# EAGLE design isp renew2 (EAGLE 6.1)
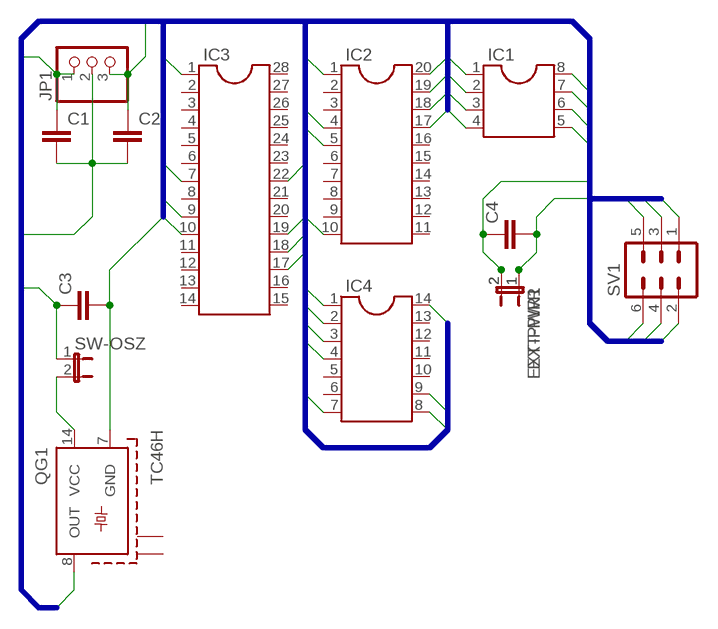
[diagram p0: schematic, sheet 1]

## Parts
C1  C-EU025-025X050  [C025-025X050]
C2  C-EU025-025X050  [C025-025X050]
C3  C-EU025-024X044  [C025-024X044]
C4  C-EU025-025X050  [C025-025X050]
EXT-PWR  JP1E  [JP1]
EXT-PWR1  JP1E  [JP1]
IC1  DIL8  [DIL08]
IC2  DIL20  [DIL20]
IC3  DIL28-3  [DIL28-3]
IC4  DIL14  [DIL14]
JP1  PINHD-1X3  [1X03]
QG1  TC46H  [TC46]
SV1  ML6  [ML6]
SW-OSZ  JP1E  [JP1]

## Nets
GND: C1.2 C2.2 C3.2 C4.2 EXT-PWR1.1 EXT-PWR.1 IC1.4 IC2.10 IC3.22 IC4.14 JP1.2 QG1.7(GND) SV1.6
MISO: IC1.6 IC2.18 IC3.18 IC4.8 SV1.1
MOSI: IC1.5 IC2.17 IC3.17 IC4.7 SV1.4
N$1: QG1.14(VCC) SW-OSZ.2
RESET: IC1.1 IC2.1 IC3.1 IC4.4 SV1.5
SCK: IC1.7 IC2.19 IC3.19 IC4.9 SV1.3
VCC: C3.1 C4.1 EXT-PWR1.2 EXT-PWR.2 IC1.8 IC2.20 IC3.7 IC4.1 SV1.2 SW-OSZ.1
XTAL1: C1.1 IC1.2 IC2.4 IC3.9 IC4.2 JP1.1 QG1.8(OUT)
XTAL2: C2.1 IC1.3 IC2.5 IC3.10 IC4.3 JP1.3
Unconnected: IC2.2 IC2.3 IC2.6 IC2.7 IC2.8 IC2.9 IC2.11 IC2.12 IC2.13 IC2.14 IC2.15 IC2.16 IC3.2 IC3.3 IC3.4 IC3.5 IC3.6 IC3.8 IC3.11 IC3.12 IC3.13 IC3.14 IC3.15 IC3.16 IC3.20 IC3.21 IC3.23 IC3.24 IC3.25 IC3.26 IC3.27 IC3.28 IC4.5 IC4.6 IC4.10 IC4.11 IC4.12 IC4.13 QG1.S@1(S1) QG1.S@2(S2)

## Buses
LINE:MOSI,MISO,RESET,SCK,VCC,GND,XTAL1,XTAL2

## Library data of the parts
C1-C4 = rcl:C-EU: CAPACITOR, European symbol
EXT-PWR EXT-PWR1 SW-OSZ = jumper:JP1E: JUMPER
IC1 = ic-package:DIL8: Dual In Line / Socket
IC2 = ic-package:DIL20: Dual In Line / Socket
IC3 = ic-package:DIL28: Dual In Line
IC4 = ic-package:DIL14: Dual In Line / Socket
JP1 = pinhead:PINHD-1X3: PIN HEADER
QG1 = crystal:TC46: Temperature Compensated Xtal Oscillator HCMOS, Clipped Sine Wave or Sine Wave Compatible Source: www.pletronics.com .. tc4.pdf; OC_FARNELL: unknown; OC_NEWARK: unknown
SV1 = con-harting-ml:ML6: HARTING; OC_FARNELL: unknown; OC_NEWARK: unknown

## Board
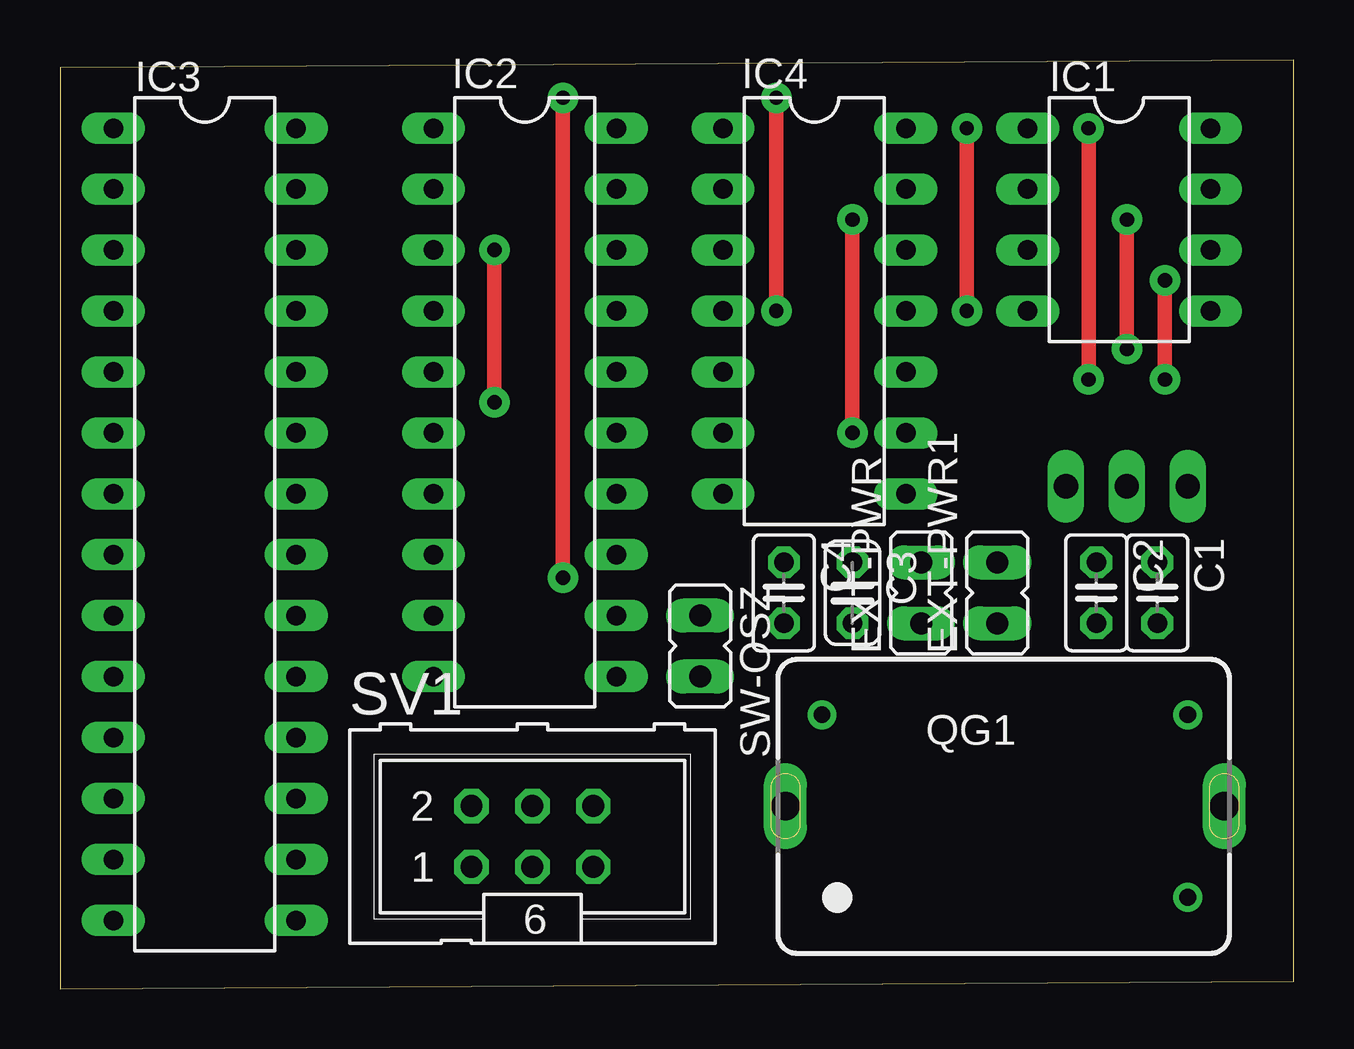
[diagram p1: board, top side]
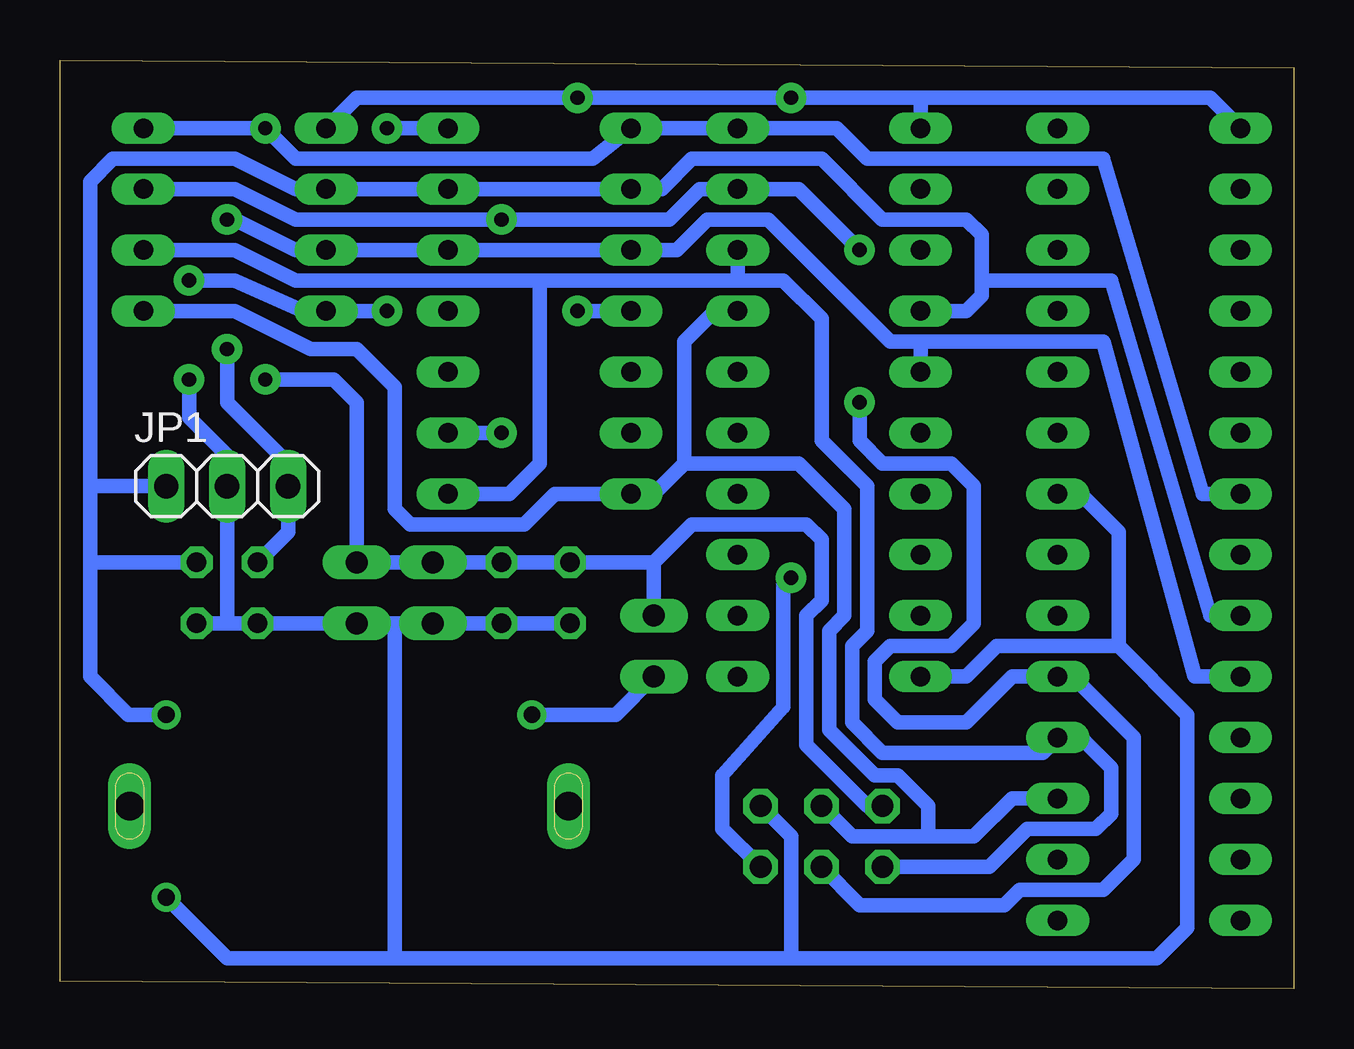
[diagram p2: board, bottom side, seen from below]

Size 51.41 x 38.72 mm. Coordinates in mm from the lower left corner, seen from the top.
Outline: 0,0 51.41,0.32 51.41,38.72 0,38.41 0,0
Copper layers (1*16): Top 0.035mm / dielectric 1.5mm / Bottom 0.035mm
Design rules: minimum track width 10mil, minimum drill 24mil, track to track 8mil, track to pad 8mil, pad to pad 8mil, via to via 8mil, smd to smd 8mil, copper to edge 40mil, drill to drill 8mil, minimum pad ring 10mil, minimum via ring 8mil, stop-mask expansion 4mil, vias tented up to drill 0mil, thermal gap 10mil

### Footprints (pad centres in the part's own frame; a part is rotated, then mirrored left to right if it is on the bottom)
C025-025X050 = drill 0.813 octagon: 1 -1.27,0; 2 1.27,0
C025-024X044 = drill 0.813 octagon: 1 -1.27,0; 2 1.27,0
JP1 = drill 0.914 long: 1 0,-1.27; 2 0,1.27
DIL08 = drill 0.813 long: 1 -3.81,-3.81; 2 -1.27,-3.81; 3 1.27,-3.81; 4 3.81,-3.81; 5 3.81,3.81; 6 1.27,3.81; 7 -1.27,3.81; 8 -3.81,3.81
DIL20 = drill 0.813 long: 1 -11.43,-3.81; 2 -8.89,-3.81; 3 -6.35,-3.81; 4 -3.81,-3.81; 5 -1.27,-3.81; 6 1.27,-3.81; 7 3.81,-3.81; 8 6.35,-3.81; 9 8.89,-3.81; 10 11.43,-3.81; 11 11.43,3.81; 12 8.89,3.81; 13 6.35,3.81; 14 3.81,3.81; 15 1.27,3.81; 16 -1.27,3.81; 17 -3.81,3.81; 18 -6.35,3.81; 19 -8.89,3.81; 20 -11.43,3.81
DIL28-3 = drill 0.813 long: 1 -16.51,-3.81; 2 -13.97,-3.81; 3 -11.43,-3.81; 4 -8.89,-3.81; 5 -6.35,-3.81; 6 -3.81,-3.81; 7 -1.27,-3.81; 8 1.27,-3.81; 9 3.81,-3.81; 10 6.35,-3.81; 11 8.89,-3.81; 12 11.43,-3.81; 13 13.97,-3.81; 14 16.51,-3.81; 15 16.51,3.81; 16 13.97,3.81; 17 11.43,3.81; 18 8.89,3.81; 19 6.35,3.81; 20 3.81,3.81; 21 1.27,3.81; 22 -1.27,3.81; 23 -3.81,3.81; 24 -6.35,3.81; 25 -8.89,3.81; 26 -11.43,3.81; 27 -13.97,3.81; 28 -16.51,3.81
DIL14 = drill 0.813 long: 1 -7.62,-3.81; 2 -5.08,-3.81; 3 -2.54,-3.81; 4 0,-3.81; 5 2.54,-3.81; 6 5.08,-3.81; 7 7.62,-3.81; 8 7.62,3.81; 9 5.08,3.81; 10 2.54,3.81; 11 0,3.81; 12 -2.54,3.81; 13 -5.08,3.81; 14 -7.62,3.81
1X03 = drill 1.016 long: 1 -2.54,0; 2 0,0; 3 2.54,0
TC46 = drill 0.7 pad 1.016: 7 7.62,-3.81; 8 7.62,3.81; 14 -7.62,3.81 | drill 1.2 pad 1.6 long: S@1 -9.144,0 | drill 1.2 pad 1.5 long: S@2 9.144,0
ML6 = drill 0.914 octagon: 1 -2.54,-1.27; 2 -2.54,1.27; 3 0,-1.27; 4 0,1.27; 5 2.54,-1.27; 6 2.54,1.27

### Placement (x,y rotation side)
C1  45.72,16.51 270 top
C2  43.18,16.51 270 top
C3  33.02,16.51 270 top
C4  30.16,16.51 270 top
EXT-PWR  35.88,16.51 0 top
EXT-PWR1  39.05,16.51 0 top
IC1  44.13,32.07 270 top
IC2  19.37,24.45 270 top
IC3  6.03,19.37 270 top
IC4  31.43,28.26 270 top
JP1  44.45,20.95 0 bottom
QG1  39.37,7.62 0 top
SV1  19.68,6.35 0 top
SW-OSZ  26.67,14.29 180 top

### Tracks (layer width: path | path; a pad name or v marks a point on that pad's centre or on a via)
GND  (via drill 0.6 pad 1.27)
  Top 0.61: v37.78,35.88 v37.78,28.26 | v46.04,29.53 v46.04,25.4
  Bottom 0.61: IC3.22 8.89,20.64 7.3,19.05 7.3,14.29 | 7.3,14.29 4.45,11.43 4.45,2.54 5.71,1.27 20.95,1.27 | SV1.6 20.95,6.35 20.95,1.27 | IC2.10 13.65,13.02 12.38,14.29 7.3,14.29 | IC4.14 v37.78,35.88 | v37.78,28.26 IC1.4 41.27,28.26 44.13,29.53 v46.04,29.53 | QG1.7 44.45,1.27 37.47,1.27 | 37.47,1.27 20.95,1.27 | C4.2 C3.2 EXT-PWR.1 37.47,15.24 | 37.47,15.24 EXT-PWR1.1 C2.2 44.45,15.24 | 44.45,15.24 C1.2 | 44.45,15.24 JP1.2 44.45,22.23 46.04,23.81 v46.04,25.4 | 37.47,15.24 37.47,1.27
MISO
  Bottom 0.61: 48.9,30.8 IC1.6 44.13,30.8 41.59,29.53 31.43,29.53 | 23.18,29.53 21.27,29.53 19.68,27.94 19.68,22.86 17.78,20.95 17.78,14.92 18.41,14.29 18.41,11.11 17.14,9.84 10.48,9.84 IC3.18 8.89,10.48 7.62,9.21 7.62,7.3 8.26,6.67 11.11,6.67 12.7,5.08 SV1.1 | IC2.18 23.18,29.53 | 31.43,29.53 31.43,21.91 32.7,20.64 IC4.8 | 23.18,29.53 31.43,29.53
MOSI
  Bottom 0.61: 22.23,28.26 IC2.17 24.13,28.26 25.4,26.99 25.4,21.91 | IC1.5 44.13,28.26 40.96,26.67 39.05,26.67 37.47,25.08 37.47,20 36.83,19.37 32.07,19.37 30.8,20.64 IC4.7 26.67,20.64 25.4,21.91 | IC3.17 11.75,7.94 13.34,6.35 15.24,6.35 | 15.24,6.35 18.41,6.35 SV1.4 | 25.4,21.91 20.64,21.91 18.73,20 18.73,15.56 19.37,14.92 19.37,10.79 17.46,8.89 16.51,8.89 15.24,7.62 15.24,6.35
N$1
  Bottom 0.61: QG1.14 28.26,11.43 SW-OSZ.2
RESET  (via drill 0.6 pad 1.27)
  Top 0.61: v20.95,17.14 v20.95,37.15 | v29.84,28.26 v29.84,37.15
  Bottom 0.61: IC3.1 3.49,37.15 15.56,37.15 | IC2.1 15.56,37.15 | 15.56,37.15 v20.95,37.15 v29.84,37.15 39.05,37.15 IC1.1 | IC4.4 v29.84,28.26 | SV1.5 23.81,6.67 23.81,8.89 21.27,11.75 21.27,16.83 v20.95,17.14
SCK  (via drill 0.6 pad 1.27)
  Top 0.61: v18.1,30.8 v18.1,24.45 | v33.02,23.18 v33.02,32.07
  Bottom 0.61: IC1.7 44.13,33.34 41.59,32.07 v33.02,32.07 26.04,32.07 24.77,33.34 IC2.19 20.64,33.34 v18.1,30.8 | SV1.3 18.1,3.49 12.06,3.49 11.43,4.13 7.94,4.13 6.67,5.4 6.67,10.48 9.21,13.02 IC3.19 11.75,13.02 13.65,11.11 16.51,11.11 17.46,12.06 17.46,13.65 16.83,14.29 14.29,14.29 13.34,15.24 13.34,20.95 14.29,21.91 17.14,21.91 18.1,22.86 v18.1,24.45 | IC4.9 v33.02,23.18
VCC  (via drill 0.6 pad 1.27)
  Top 0.61: v42.86,35.88 v42.86,25.4
  Bottom 0.61: IC1.8 v42.86,35.88 41.59,34.61 29.21,34.61 IC4.1 IC2.20 19.05,35.88 17.78,34.61 7.94,34.61 3.81,20.64 IC3.7 | SV1.2 17.78,7.62 20.32,10.16 20.32,15.56 19.68,16.19 19.68,18.73 20.32,19.37 25.08,19.37 26.67,17.78 | 26.67,17.78 SW-OSZ.1 | 26.67,17.78 C4.1 C3.1 EXT-PWR.2 EXT-PWR1.2 39.05,24.45 40.01,25.4 v42.86,25.4
XTAL1
  Bottom 0.61: 13.02,29.53 7.62,29.53 3.49,15.56 IC3.9 | 13.02,29.53 13.02,31.43 13.65,32.07 17.14,32.07 19.68,34.61 25.08,34.61 26.35,33.34 IC4.2 IC1.2 41.59,33.34 44.13,34.61 49.21,34.61 50.16,33.66 50.16,20.95 | IC2.4 13.65,28.26 13.02,28.89 13.02,29.53 | QG1.8 48.58,11.43 50.16,13.02 50.16,17.78 | 50.16,17.78 50.16,20.95 | JP1.1 50.16,20.95 | C1.1 50.16,17.78
XTAL2  (via drill 0.6 pad 1.27)
  Top 0.61: v44.45,32.07 v44.45,26.67
  Bottom 0.61: IC2.5 15.56,26.99 | 15.56,26.99 16.83,26.99 21.91,32.07 24.45,32.07 25.72,30.8 IC4.3 IC1.3 41.59,30.8 44.13,32.07 v44.45,32.07 | 15.56,26.99 7.94,26.99 4.13,13.02 IC3.10 | v44.45,26.67 44.45,24.45 41.91,21.91 JP1.3 41.91,19.05 C2.1